# Altium schematic sheet Power.SchDoc
size A; SheetNumber: 4; SheetTotal: 9
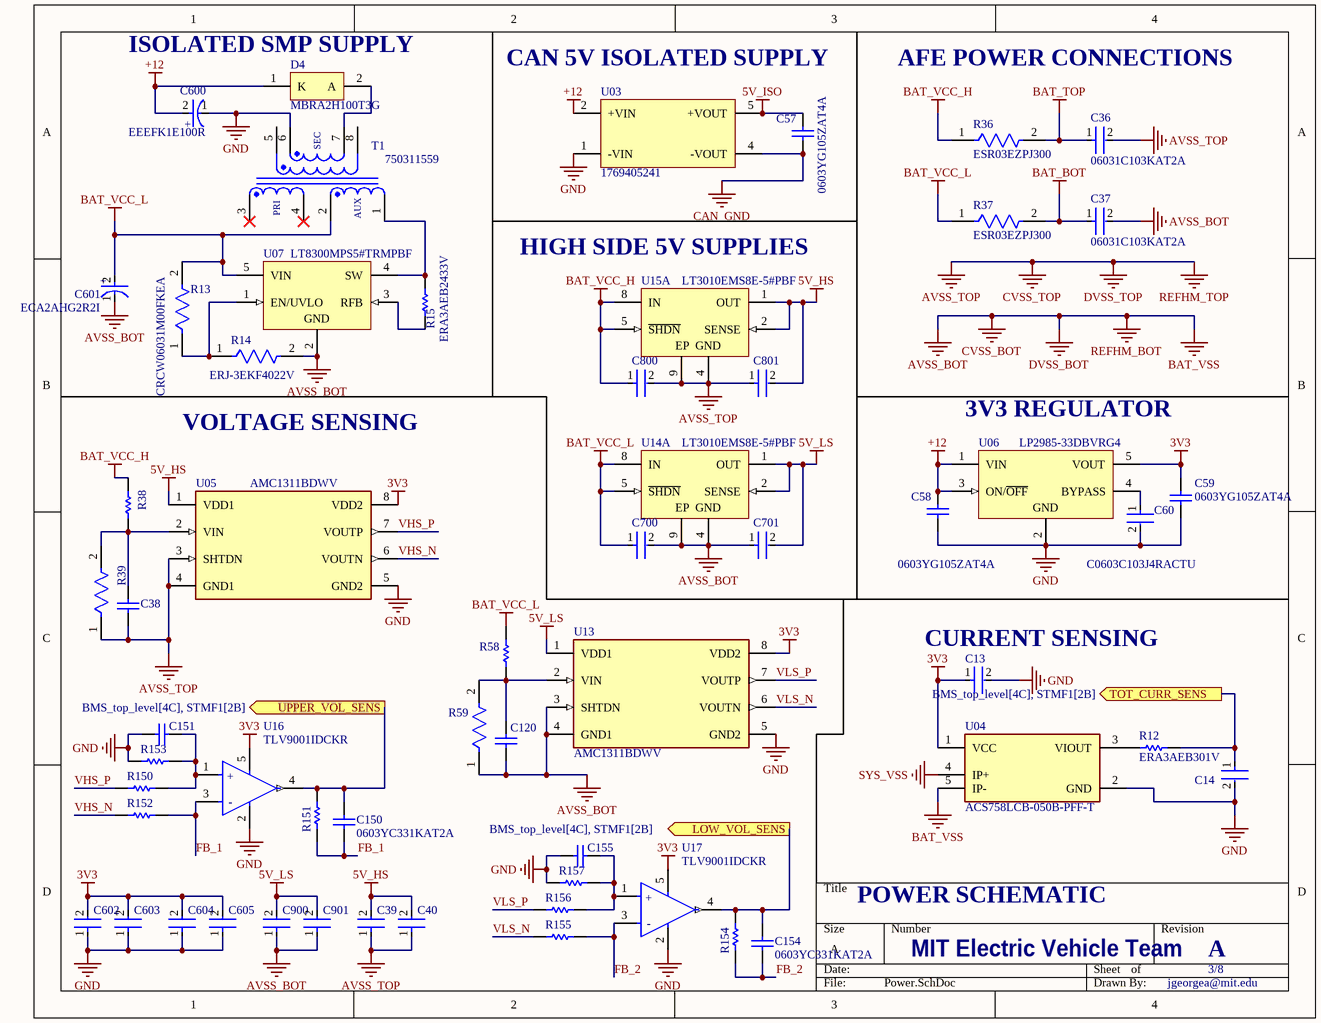
[diagram p0: Power.SchDoc]

## Parts
C13  CGA3E2X7R1H104K080AA  [FP-CGA3E-0_3-0_1-IPC_A]  (value not drawn)
C14  CGA3E2X7R1H104K080AA  [FP-CGA3E-0_3-0_1-IPC_A]  (value not drawn)
C36  06031C103KAT2A  [FP-0603-L_1_6_0_15-W_0_81-IPC_C]
C37  06031C103KAT2A  [FP-0603-L_1_6_0_15-W_0_81-IPC_C]
C38  CC0603JRNPO9BN101  [CAPC1608X90X40ML10T20]  (value not drawn)
C39  C2012X7S2A105K125AE  [FP-C2012-125-IPC_B]  (value not drawn)
C40  CGA3E2X7R1H104K080AA  [FP-CGA3E-0_3-0_1-IPC_A]  (value not drawn)
C57  0603YG105ZAT4A  [CAPC1608X90X35ML15T15]
C58  0603YG105ZAT4A  [CAPC1608X90X35ML15T15]
C59  0603YG105ZAT4A  [CAPC1608X90X35ML15T15]
C60  C0603C103J4RACTU  [FP-C0603C-CF-MFG]
C120  CC0603JRNPO9BN101  [CAPC1608X90X40ML10T20]  (value not drawn)
C150  0603YC331KAT2A  [CAPC1608X90X35ML15T15]
C151  0603YC331KAT2A  [CAPC1608X90X35ML15T15]  (value not drawn)
C154  0603YC331KAT2A  [CAPC1608X90X35ML15T15]
C155  0603YC331KAT2A  [CAPC1608X90X35ML15T15]  (value not drawn)
C600  EEEFK1E100R  [FP-FKB-MFG]
C601  ECA2AHG2R2I  [FP-RAD-TH-D_5_0_5-L_11_1-MFG]
C602  C2012X7S2A105K125AE  [FP-C2012-125-IPC_B]  (value not drawn)
C603  C2012X7S2A105K125AE  [FP-C2012-125-IPC_B]  (value not drawn)
C604  CGA3E2X7R1H104K080AA  [FP-CGA3E-0_3-0_1-IPC_A]  (value not drawn)
C605  CGA3E2X7R1H104K080AA  [FP-CGA3E-0_3-0_1-IPC_A]  (value not drawn)
C700  C2012X7S2A105K125AE  [FP-C2012-125-IPC_B]  (value not drawn)
C701  C2012X7S2A105K125AE  [FP-C2012-125-IPC_B]  (value not drawn)
C800  C2012X7S2A105K125AE  [FP-C2012-125-IPC_B]  (value not drawn)
C801  C2012X7S2A105K125AE  [FP-C2012-125-IPC_B]  (value not drawn)
C900  C2012X7S2A105K125AE  [FP-C2012-125-IPC_B]  (value not drawn)
C901  CGA3E2X7R1H104K080AA  [FP-CGA3E-0_3-0_1-IPC_A]  (value not drawn)
D4  MBRA2H100T3G  [ONSC-SMA-2-403D-02_V]
R12  ERA3AEB301V  [RESC1608X55X30LL20T20]
R13  CRCW06031M00FKEA  [FP-CRCW0603-e3-MFG]
R14  ERJ-3EKF4022V  [FP-ERJ3EK-IPC_C]
R15  ERA3AEB2433V  [RESC1608X55X30NL20T20]
R36  ESR03EZPJ300  [FP-ESR03-MFG]
R37  ESR03EZPJ300  [FP-ESR03-MFG]
R38  ERJ-3GEYJ245V  [RESC1608X55X30ML15T15]  (value not drawn)
R39  RT0603FRE0739K2L  [FP-RT0603-MFG]  (value not drawn)
R58  ERJ-3GEYJ245V  [RESC1608X55X30ML15T15]  (value not drawn)
R59  RT0603FRE0739K2L  [FP-RT0603-MFG]  (value not drawn)
R150  ERJ-3EKF3301V  [RESC1609X55X30ML15T15]  (value not drawn)
R151  ERJ-3EKF3301V  [RESC1609X55X30ML15T15]  (value not drawn)
R152  ERJ-3EKF3301V  [RESC1609X55X30ML15T15]  (value not drawn)
R153  ERJ-3EKF3301V  [RESC1609X55X30ML15T15]  (value not drawn)
R154  ERJ-3EKF3301V  [RESC1609X55X30ML15T15]  (value not drawn)
R155  ERJ-3EKF3301V  [RESC1609X55X30ML15T15]  (value not drawn)
R156  ERJ-3EKF3301V  [RESC1609X55X30ML15T15]  (value not drawn)
R157  ERJ-3EKF3301V  [RESC1609X55X30ML15T15]  (value not drawn)
T1  750311559  [WE-FLYLT_EP7_L9.78W9.50H10.54]
U03  1769405241  [WPME-FISM_SMT-8_L13.2W11.4H7.25]
U04  ACS758LCB-050B-PFF-T  [FP-CB-5-PFF-MFG]
U05  AMC1311BDWV  [FP-DWV0008A-MFG]
U06  LP2985-33DBVRG4  [DBV0005A_M]
U07  LT8300MPS5#TRMPBF  [LT-S5-5-TSOT-23_N]
U13  AMC1311BDWV  [FP-DWV0008A-MFG]
U14  LT3010EMS8E-5#PBF  [LT-MS8E-8-1880X1680TP_L]  (part A of 2)
U15  LT3010EMS8E-5#PBF  [LT-MS8E-8-1880X1680TP_L]  (part A of 2)
U16  TLV9001IDCKR  [FP-DCK0005A-MFG]
U17  TLV9001IDCKR  [FP-DCK0005A-MFG]

## Ports
LOW_VOL_SENS (out, see BMS_top_level[4C], STMF1[2B]), TOT_CURR_SENS (out, see BMS_top_level[4C], STMF1[2B]), UPPER_VOL_SENS (out, see BMS_top_level[4C], STMF1[2B])

## Nets
3V3: C13.1 C59.2 C602.2 C603.2 C604.2 C605.2 U04.1(VCC) U05.8(VDD2) U06.5(VOUT) U13.8(VDD2) U16.5(V+) U17.5(V+)
5V_HS: C39.2 C40.2 C801.2 U05.1(VDD1) U15.1(OUT) U15.2(SENSE)
5V_ISO: C57.2 U03.5(+VOUT)
5V_LS: C701.2 C900.2 C901.2 U13.1(VDD1) U14.1(OUT) U14.2(SENSE)
+12: C58.2 C600.2(A) D4.1(K) U03.2(+VIN) U06.1(VIN) U06.3(ON/~{OFF})
AVSS_BOT: C37.2 C120.1 C601.1(C) C700.2 C701.1 C900.1 C901.1 R14.2 R59.1 U04.5(IP-) U07.2(GND) U13.3(SHTDN) U13.4(GND1) U14.4(GND) U14.9(EP)  [also labelled BAT_VSS, CVSS_BOT, DVSS_BOT, REFHM_BOT]
AVSS_TOP: C36.2 C38.1 C39.1 C40.1 C800.2 C801.1 R39.1 U05.3(SHTDN) U05.4(GND1) U15.4(GND) U15.9(EP)  [also labelled CVSS_TOP, DVSS_TOP, REFHM_TOP]
BAT_BOT: C37.1 R37.2
BAT_TOP: C36.1 R36.2
BAT_VCC_H: C800.1 R36.1 R38.2 U15.5(~{SHDN}) U15.8(IN)
BAT_VCC_L: C601.2(A) C700.1 R13.2 R37.1 R58.2 T1.2 U07.5(VIN) U14.5(~{SHDN}) U14.8(IN)
CAN_GND: C57.1 U03.4(-VOUT)
GND: C13.2 C14.2 C58.1 C59.1 C60.2 C151.1 C155.1 C600.1(C) C602.1 C603.1 C604.1 C605.1 R153.2 R157.2 T1.6 U03.1(-VIN) U04.2(GND) U05.5(GND2) U06.2(GND) U13.5(GND2) U16.2(V-) U17.2(V-)
SYS_VSS: U04.4(IP+)
FB_1: C150.1 R151.1 R152.1 U16.3(IN-)
FB_2: C154.1 R154.1 R155.1 U17.3(IN-)
LOW_VOL_SENS: C154.2 R154.2 U17.4(OUT) ; port LOW_VOL_SENS
TOT_CURR_SENS: C14.1 R12.2 ; port TOT_CURR_SENS
UPPER_VOL_SENS: C150.2 R151.2 U16.4(OUT) ; port UPPER_VOL_SENS
VHS_N: R152.2 U05.6(VOUTN)
VHS_P: R150.2 U05.7(VOUTP)
VLS_N: R155.2 U13.6(VOUTN)
VLS_P: R156.2 U13.7(VOUTP)
NetC38_2: C38.2 R38.1 R39.2 U05.2(VIN)
NetC60_1: C60.1 U06.4(BYPASS)
NetC120_2: C120.2 R58.1 R59.2 U13.2(VIN)
NetC151_2: C151.2 R150.1 R153.1 U16.1(IN+)
NetC155_2: C155.2 R156.1 R157.1 U17.1(IN+)
NetD4_2: D4.2(A) T1.7
NetR12_1: R12.1 U04.3(VIOUT)
NetR13_1: R13.1 R14.1 U07.1(EN/UVLO)
NetR15_1: R15.1 U07.3(RFB)
NetR15_2: R15.2 T1.1 U07.4(SW)

Not connected (* = marked no-connect by the designer): T1 3* 4* 5 8

## Notes on the sheet
- (near D4) ISOLATED SMP SUPPLY
- CAN 5V ISOLATED SUPPLY
- AFE POWER CONNECTIONS
- (near U15) HIGH SIDE 5V SUPPLIES
- VOLTAGE SENSING
- (near U06) 3V3 REGULATOR
- (near C13) CURRENT SENSING
- POWER SCHEMATIC
- MIT Electric Vehicle Team
- A
- 3/8
- jgeorgea@mit.edu
- (in symbol CMP-03913-24618066-1) SEC; PRI; AUX
- (in symbol CMP-04895-000186-1) +; -
- (in symbol CMP-05427-000055-1) +
- (in symbol CMP-05427-001174-1) +

## Library data of the parts
C13 C14 C40 C604 C605 C901 = CMP-2000-07546-2: Cap Ceramic 100nF 50V X7R 10% Pad SMD 0603 +125°C Automotive T/R; Weight: 7.1E-05oz; Composition: Ceramic; Max Operating Temperature: 125°C; Termination: SMD/SMT; Dielectric: X7R; Length: 1.6mm; Package Quantity: 1; REACH SVHC: No SVHC; Lead Free: Lead Free; Case Code (Metric): 1608; Min Operating Temperature: -55°C; Packaging: Tape and Reel; Tolerance: 10%; Voltage Rating: 50V; Case Code (Imperial): 0603; Capacitance: 100nF; Case/Package: 0603; Voltage Rating (DC): 50V; Depth: 0.8mm; Radiation Hardening: No; Ratings: AEC-Q200; Mount: Surface Mount; Voltage: 50V; Thickness: 0.035inch; Width: 0.8mm; Height: 0.8mm
C36 C37 = CMP-2006-04074-2: General Purpose Ceramic Capacitor, 0603, 10nF, 10%, X7R, 15%, 100V; Dissipation Factor: 2.5%; Insulation Resistance: 100GR; Voltage: 100V; Series: -; Case Code (Imperial): 0603; Mount: Surface Mount; Dielectric: X7R; Package Quantity: 1; Construction: Flat; Max Operating Temperature: 125°C; Tolerance: 10%; RoHS Compliant: Yes; Case/Package: 0603; Contact Plating: Tin; Height: 0.9mm; Voltage Rating: 100V; Depth: 0.81mm; Radiation Hardening: No; Termination: SMD/SMT; Case Code (Metric): 1608; Number of Pins: 2; Length: 1.6mm; Lead Free: Lead Free; Thickness: 0.035inch; Packaging: Tape and Reel; Capacitance: 10nF; Width: 0.032inch; Min Operating Temperature: -55°C; Voltage Rating (DC): 100V; REACH SVHC: No SVHC
C38 C120 = CMP-2100-03594-1: Chip Capacitor, 100 pF, +/- 5%, 50 V, -55 to 125 degC, 0603 (1608 Metric), RoHS, Tape and Reel; Manufacturer: Yageo; Capacitance: 100pF; Voltage Rating (DC): 50V; Dielectric: C0G; Temperature Coefficient: 30ppm/degC; Insulation Resistance: 100GR; Datasheet Version: Rev. 14, 07/2016; Manufacturer URL: http://www.yageo.com/; Packaging: TapeandReel; Mount: SurfaceMount; RoHSCompliant: True; Package Reference: 0603; Tolerance: 5%; Max Operating Temperature: 125degC; Case Code (Imperial): 0603; Number of Pins: 2; Width: 0.8mm; Case Code (Metric): 1608; Voltage: 50V; REACH SVHC: Unknown; Package Description: 2-Pin Surface Mount Device, Body 1.6 x 0.8 mm; Composition: Ceramic; Lead Free: LeadFree; Min Operating Temperature: -55degC; Radiation Hardening: No; Depth: 0.8mm; Thickness: 0.035inch; Datasheet URL: http://www.yageo.com/documents/recent/UPY-GP_NP0_16V-to-50V_14.pdf; Termination: SMD/SMT; Package Quantity: 1; Length: 1.6mm; Voltage Rating: 50V; Height: 0.8mm; Case/Package: 0603
C39 C602 C603 C700 C701 C800 C801 C900 = CMP-08246-004333-1: CAP CER 1UF 100V X7S 0805; Tolerance: 10%; Case Code (Metric): 2012; Resistor Type: Ceramic; Voltage Rating (DC): 100V; RoHS Compliant: Yes; Mount: Surface Mount; Min Operating Temperature: -55°C; Voltage Rating: 100V; Series: C; Width: 0.05inch; Max Operating Temperature: 125°C; Height: 1.25mm; Capacitance: 1uF; Length: 2mm; Dielectric: X7S; Case/Package: 0805; Packaging: Tape and Reel; Features: Soft Termination; Lead Free: Lead Free; Case Code (Imperial): 0805; Thickness: 0.049inch; Termination: SMD/SMT; Package Quantity: 1; Depth: 1.25mm
C57-C59 = CMP-2006-04543-1: Manufacturer: AVX Interconnect / Elco; Part Number: 0603YG105ZAT4A
C60 = CMP-2006-03033-2: CAP CER 10000PF 16V 5% X7R 0603; Manufacturer: KEMET; Value: 10,000 pF; Tolerance: 0.05; Material: Ceramic; Temperature Coefficient: 30ppm/°C; Automotive Grade: Grade 1; Height: 0.87mm; Temperature Range High: +125°C; Temperature Range Low: -55°C; Automotive: Yes; Package: C0603C-CF; Temperature Characteristic: X7R; RoHS: TRUE; Device Class L2: Capacitors; Device Class L3: Ceramic Capacitors; Device Class L1: Passive Components; Manufacturer Part Number: C0603C103J4RACTU; Voltage Rating: 16 V; ComponentLink2URL: https://api.kemet.com/component-edge/download/datasheet/C0603C100J5GACAUTO.pdf; ComponentLink2Description: Datasheet; Mouser Description: Multilayer Ceramic Capacitors MLCC - SMD/SMT 16volts 10000pF X7R 5%; Temperature: -55°C to +125°C; Digikey Description: CAP CER 10000PF 16V 5% X7R 0603; Octopart: https://octopart.com/c0603c103j4ractu-kemet-9139447; Capacitance: 10,000 pF; Category: Cap; Lead Free: Yes
C150 C151 C154 C155 = CMP-2006-04513-1: Manufacturer: AVX Interconnect / Elco; Part Number: 0603YC331KAT2A
C600 = CMP-05427-000055-1: CAP ALUM 10UF 20% 25V SMD; ESR (Equivalent Series Resistance): 1.35R; Life (Hours): 2000Hour; Dielectric Material: Aluminium; Leakage Current: 3uA; Ripple Current (AC): 90mA; Polarity: Polar; Voltage: 25V; Voltage Rating: 25V; Number of Pins: 2; Package Quantity: 1; Max Operating Temperature: 105°C; Tolerance: 20%; Voltage Rating (DC): 25V; Packaging: Tape and Reel; Impedance: 1.35R; Case/Package: Radial; Series: FK; Height - Seated (Max): 0.24inch; Diameter: 4mm; Length: 5.8mm; Construction: Cylindrical; Height: 5.8mm; Mount: Surface Mount; REACH SVHC: No SVHC; Termination: SMD/SMT; Capacitance: 10uF; Lead Free: Lead Free; RoHS Compliant: Yes; Contact Plating: Tin; Width: 5.5mm; Radiation Hardening: No; Min Operating Temperature: -55°C; Ripple Current: 90mA
C601 = CMP-05427-001174-1: Aluminum Electrolytic Capacitors (Radial Lead Type) AEC-Q200 Qualified 2.2uF ±20% 100V; Lead Diameter: 0.5mm; Life (Hours): 1000Hour; Lead/Base Style: Straight; Ripple Current: 21mA; Mount: Through Hole; Max Operating Temperature: 105°C; Length: 11mm; Voltage Rating (DC): 100V; Case/Package: Radial; Package Quantity: 2000; Lead Pitch: 2.5mm; Series: NHG; Min Operating Temperature: -55°C; Tolerance: 20%; Capacitance: 2.2uF; RoHS Compliant: Yes; Termination: Radial; Packaging: Ammo Pack; Height: 11mm; Diameter: 5mm; Radiation Hardening: No
D4 = CMP-1055-00325-1: Schottky Power Rectifier, 2-Pin SMA, Pb-Free, Tape and Reel; Manufacturer: On Semiconductor; IFSM Max (A): 130; Configuration: Single; PackageDescription: 2-Pin Small Molded Package, J-Bend Lead, Body 2.605 x 4.315 mm; ComponentLink2URL: http://www.onsemi.cn/pub_link/Collateral/MBRS2H100-D.PDF; RoHS: TRUE; ComponentLink3URL: http://www.onsemi.com/pub_link/Collateral/403D-02.PDF; PartNumber: MBRA2H100T3G; ComponentLink2Description: Datasheet; ComponentLink3Description: Package Specification; PackageReference: SMA-2-403D-02; ComponentLink1Description: Manufacturer URL; DatasheetVersion: Rev. 8; ComponentLink1URL: http://www.onsemi.com/; PackageVersion: Rev. G, 07/2012; Mounting Technology: Surface Mount; Packing: Tape and Reel
R12 = CMP-2000-00025-1: Manufacturer: Panasonic; Part Number: ERA3AEB301V
R13 = CMP-2000-03013-2: RES Thick Film, 1MΩ, 1%, 0.1W, 100ppm/°C, 0603; Max Power Dissipation: 100mW; Resistance: 1MR; Voltage Rating (DC): 75V; Depth: 0.85mm; Max Operating Temperature: 155°C; Length: 1.55mm; Power Rating: 100mW; Military Standard: Not; Features: Automotive AEC-Q200; Min Operating Temperature: -55°C; Number of Pins: 2; Mount: Surface Mount; Package Quantity: 10; Packaging: Tape and Reel; Height: 0.45mm; Radiation Hardening: No; Case Code (Metric): 1608; Temperature Coefficient: 100ppm/°C; Width: 0.85mm; Composition: Thick Film; Termination: SMD/SMT; Tolerance: 1%; Number of Terminations: 2; Lead Free: Lead Free; Contact Plating: Tin; Case/Package: 0603; Weight: 7.1E-05oz; Voltage Rating: 75V; Case Code (Imperial): 0603
R14 = CMP-2000-00486-2: RES SMD 40.2K OHM 1% 1/10W 0603; Power Rating: 100mW; Resistance: 40.2kR; Voltage Rating: 75V; Temperature Coefficient: 100ppm/°C; Voltage Rating (DC): 50V; Military Standard: Not; Lead Free: Lead Free; Resistor Type: Thick Film; Weight: 7.1E-05oz; Resistance Tolerance: 1%; Number of Terminations: 2; Min Operating Temperature: -55°C; Depth: 0.8mm; Max Power Dissipation: 100mW; Length: 1.6mm; Case Code (Imperial): 0603; Max Operating Temperature: 155°C; Series: ERJ; Radiation Hardening: No; Features: Automotive AEC-Q200; Mount: Surface Mount; Package Quantity: 1; Packaging: Tape and Reel; Height: 0.45mm; Width: 0.031inch; RoHS Compliant: Yes; Case/Package: 0603; Tolerance: 1%; Contact Plating: Tin; Technology: THICK FILM; Construction: Rectangular; Case Code (Metric): 1608; Termination: SMD/SMT
R15 = CMP-2000-00968-1: Manufacturer: Panasonic; Part Number: ERA3AEB2433V
R36 R37 = CMP-08839-029539-1: 30Ω ±5% 0.25W 0603 Anti-Surge Chip Resistor AEC-Q200; Temperature Coefficient: 200ppm/°C; Max Power Dissipation: 250mW; Resistance: 30R; Case Code (Imperial): 0603; Case Code (Metric): 1608; Height: 0.022inch; Number of Terminations: 2; Max Operating Temperature: 155°C; Length: 0.063inch; Package Quantity: 5000; Features: Automotive AEC-Q200; Tolerance: 5%; Width: 0.031inch; RoHS Compliant: Yes; Packaging: Tape and Reel; Min Operating Temperature: -55°C; Resistor Type: Thick Film; Case/Package: 0603; Series: ESR
R38 R58 = CMP-2000-00756-1: Manufacturer: Panasonic; Part Number: ERJ-3GEYJ245V
R39 R59 = CMP-2000-04739-2: RES SMD 39.2K OHM 1% 1/10W 0603; Manufacturer: Yageo; Temperature Coefficient: 50 ppm/°C; Resistance: 39.2KΩ; Tolerance: 0.01; Voltage Rating: 75V; Value: 39.2KΩ; Power Rating: 0.1W; ComponentLink2Description: Datasheet; Manufacturer Part Number: RT0603FRE0739K2L; Device Class L1: Passive Components; Temperature Range Low: -55°C; Package: RT0603; ComponentLink2URL: http://www.yageo.com/documents/recent/PYu-RT_1-to-0.01_RoHS_L_9.pdf; Device Class L2: Resistors; Octopart: https://octopart.com/rt0603fre0739k2l-yageo-1367269; Automotive: No; Digikey Description: RES SMD 39.2K OHM 1% 1/10W 0603; Temperature: -55°C to +155°C; Category: Res; Series: RT; RoHS: TRUE; Temperature Range High: +155°C; Device Class L3: Chip SMD Resistors; Composition: Thin Film; Height: 0.55mm; Footprint Url: http://www.yageo.com/exep/pages/download/literatures/PYu-R_Mount_10.pdf; Mouser Description: Thin Film Resistors - SMD 1/10W 39.2K ohm 1% 50ppm; Lead Free: Yes; Ipc Land Pattern Name: RESC16080X45
R150-R157 = CMP-2000-00436-2: Chip Resistors, 3.3 KOhm, +/- 1%, 0.1 W, 0603 (1608 Metric), -55 to 155 degC, RoHS, Tape and Reel; Manufacturer: Panasonic; Max Power Dissipation: 100mW; Voltage Rating: 75V; Temperature Coefficient: 100ppm/degreesC; Datasheet Version: 42095.0; Width: 0.8mm; Mount: SurfaceMount; Radiation Hardening: No; Package URL: http://www.st.com/st-web-ui/static/active/en/resource/technical/document/datasheet/CD00001320.pdf; Depth: 0.8mm; Package Description: 2-Pin Surface Mount Device, Body 1.6 x 0.85 mm; Package Quantity: 1; Contact Plating: Tin; Length: 1.6mm; Max Operating Temperature: 155degC; RoHSCompliant: true; Datasheet URL: https://industrial.panasonic.com/cdbs/www-data/pdf/RDA0000/AOA0000C283.pdf; Height: 0.022inch; Military Standard: Not; Termination: SMD/SMT; Case Code (Metric): 1608; Composition: ThickFilm; Resistance: 3.3KOhm; Packaging: TapeandReel; Min Operating Temperature: -55degC; Case/Package: 0603; Voltage Rating (DC): 75V; Lead Free: LeadFree; Package Reference: 0603; Power Rating: 100mW; Manufacturer URL: http://www.panasonic.com/; Case Code (Imperial): 0603; REACH SVHC: NoSVHC; Number of Terminations: 2; Number of Pins: 2; Tolerance: 1%
T1 = CMP-03913-24618066-1: 750311559 Flyback Converters For For DC/DC Converters SMPS Transformer 1500Vrms Isolation 200 ~ 300kHz Surface; DC Resistance (DCR): 725mΩ; Inductance: 1.5µH; Power Rating: 3W; Height: 8.64mm; NexarPartId: 24618066; Height - Seated (Max): 10.54mm; Frequency: 300kHz; Max Operating Temperature: 125°C; RoHS: Compliant; Lead Free: Lead Free; Length: 9.77mm; Mount: Surface Mount; Width: 9.14mm; Termination: SMD/SMT; Min Operating Temperature: -40°C
U03 = CMP-03913-130378542-1: 1769405241 WPME-FISM Fixed Isolated SIP/SMT Module; Output Power: 2W; Max Output Voltage: 5V; Isolation Voltage: 3kV; Max Input Voltage: 13.2V; Output Current: 400mA; Min Input Voltage: 10.8V; Max Switching Frequency: 600kHz; NexarPartId: 130378542; Length: 13.2mm; Width: 11.4mm; Height: 7.25mm
U04 = CMP-82923-000254-1: SENSOR CURRENT HALL 50A AC/DC; Operating Supply Voltage: 5V; Max Supply Current: 13.5mA; Frequency: 120kHz; Quiescent Current: 10mA; Response Time: 4us; Sensitivity: 40mV/A; Output Current: 1mA; Linearity: 1%; Polarity: Bidirectional; Accuracy: 2%; Number of Channels: 1; Max Supply Voltage: 5.5V; Min Supply Voltage: 3V; Radiation Hardening: No; Packaging: Rail/Tube; Length: 10mm; Height: 7mm; Lead Free: Lead Free; Current Sensing: 50A; Number of Pins: 5; Min Operating Temperature: -40°C; RoHS Compliant: Yes; REACH SVHC: No SVHC; Max Operating Temperature: 150°C; Package Quantity: 34; Bandwidth: 120kHz; Mount: Through Hole; Width: 13mm; Series: -
U05 U13 = CMP-04893-000001-1: IC ISOLATION 8SOIC; Manufacturer: Texas Instruments; Input Offset Voltage: -1.1mV; Standoff Height: 0.36mm; Max Junction Temp: +150°C; Number Of Channels: 1; Input Bias Current: 0.0035uA; Max Supply Voltage: 5.5V; Min Supply Voltage: 3V; Nominal Supply Current: 1.3-7100uA; Temperature Range Low: -55°C; Device Class L3: unset; RoHS: TRUE; Digikey Description: IC ISOLATION 8SOIC; Lead Free: Yes; Device Class L1: Integrated Circuits (ICs); Manufacturer Part Number: AMC1311BDWV; ComponentLink2URL: http://www.ti.com/lit/ds/symlink/amc1311.pdf; Height: 2.8mm; Octopart: https://octopart.com/amc1311bdwv-texas+instruments-88030782; Device Class L2: Linear ICs; Ambient Temperature Range Low: -40°C; Category: IC; Ipc Land Pattern Name: SOIC127P1150X280-8; ComponentLink2Description: Datasheet; Temperature: -55°C to +125°C; Ambient Temperature Range High: +125°C; Automotive: No; Mouser Description: Isolated Amplifier High-Impedance 2V Input Reinforced 3V to 5.5V 8-Pin SOIC Tube; Temperature Range High: +125°C; Package: DWV0008A
U06 = CMP-0758-00079-2: Single Output Low Noise LDO, 150 mA, Fixed 3.3 V Output, 1.5% Tolerance, 2.2 to 16 V Input, Low IQ, 5-Pin SOT-23 (DBV), -40 to 125 degC, Green (RoHS & no Sb/Br), Tape and Reel; Manufacturer: Texas Instruments; Iq (Typ) (mA): 0.85; Fixed Output Options (V): 3.3; Output Options: Fixed Output; Vdo (Typ) (mV): 280; Iout (Max) (A): 0.15; Accuracy (%): 1.5; Packing: Tape and Reel; ComponentLink2URL: http://www.ti.com/lit/ds/symlink/lp2985-50.pdf; ComponentLink2Description: Datasheet; ComponentLink1Description: Manufacturer URL; Operating Temperature Range (degC): -40 to 125; PackageVersion: 4073253-4/L; Vin (V): 2.2 to 16; DatasheetVersion: SLVS522N; PackageReference: DBV0005A; PackageDescription: 5-Pin Plastic Small Outline, Body 2.9 x 1.6 mm, Pitch 0.95 mm; ComponentLink3Description: Package Specification; ComponentLink1URL: http://www.ti.com/; PartNumber: LP2985-33DBVRG4; RoHS: TRUE; ComponentLink3URL: http://www.ti.com/litv/pdf/mpds018j; Mounting Technology: Surface Mount
U07 = CMP-0491-01586-1: Micropower Isolated Flyback Converter with 150 V / 260 mA Switch, 5-pin SOT23 (S5-5), -55 to 150 degC, Pb-Free, Mini Tape and Reel; Manufacturer: Linear Technology; Number of Outputs: 1; PartNumber: LT8300MPS5#TRMPBF; PackageVersion: Jun-10; PackageReference: S5-5; ComponentLink3URL: http://cds.linear.com/docs/en/packaging/SOT_5_05-08-1635.pdf; Packing: Mini Tape and Reel; ComponentLink2Description: Datasheet; RoHS: TRUE; ComponentLink1Description: Manufacturer URL; Mounting Technology: Surface Mount; ComponentLink1URL: http://www.linear.com/; ComponentLink3Description: Package Specification; Code_JEDEC: MO-193; ComponentLink2URL: http://cds.linear.com/docs/en/datasheet/8300f.pdf; PackageDescription: 5-Pin Plastic TSOT-23, Body 1.63 x 2.90 mm, Pitch 0.95 mm
U14 U15 = CMP-0476-00809-1: 50 mA, Low Dropout Micropower Linear Regulator, 3 to 80 V Vin, 5 V Vout, 8-pin SOP (MS8E-8), -40 to 125 degC, Pb-Free; Manufacturer: Linear Technology; Vin Max(V): 80; Iout(mA): 50; Shutdown Current(uA): 1; Dropout Voltage(V): 0.3; Isupply(mA): 0.03; PSRR(dB): 68; Vin Min(V): 3; Discrete Pass Element: no; Output Voltage: 5; Noise(uV): 100; PackageVersion: Rev. F; ComponentLink1URL: http://www.linear.com/; ComponentLink3Description: Package Specification; PackageReference: MS8E-8; RoHS: TRUE; Number of Outputs: 1; ComponentLink3URL: http://cds.linear.com/docs/en/datasheet/3080fc.pdf; ComponentLink2URL: http://cds.linear.com/docs/en/datasheet/30105fe.pdf; PackageDescription: 8-Pin Plastic MSOP, Exposed Die Pad, Body 3 x 3 mm, Pitch 0.65 mm; ComponentLink2Description: Datasheet; PartNumber: LT3010EMS8E-5#PBF; DatasheetVersion: Rev. E; ComponentLink1Description: Manufacturer URL; Mounting Technology: Surface Mount
U16 U17 = CMP-04895-000186-1: IC CMOS 1 CIRCUIT SC70-5; Number of Channels: 1; Input Bias Current: 5pA; Operating Supply Current: 60uA; Gain Bandwidth Product: 1MHz; Slew Rate: 2V/µs; Input Offset Voltage (Vos): 400uV; Output Current per Channel: 40mA; Max Operating Temperature: 125°C; Min Operating Temperature: -40°C; Mount: Surface Mount; RoHS Compliant: Yes; Packaging: Tape and Reel; Number of Circuits: 1